# Altium schematic sheet EDU_High-Speed-Design_CPU_PCIe.SchDoc: CPU PCIe
size 279 x 215 mm; Date: not used; ApprovedBy: not used; CheckedBy: not used; Author: not used; DrawnBy: not used; Organization: not used; Address4: not used; SheetNumber: 20; SheetTotal: 26; Time: not used; ImagePath: not used; Application_BuildNumber: not used
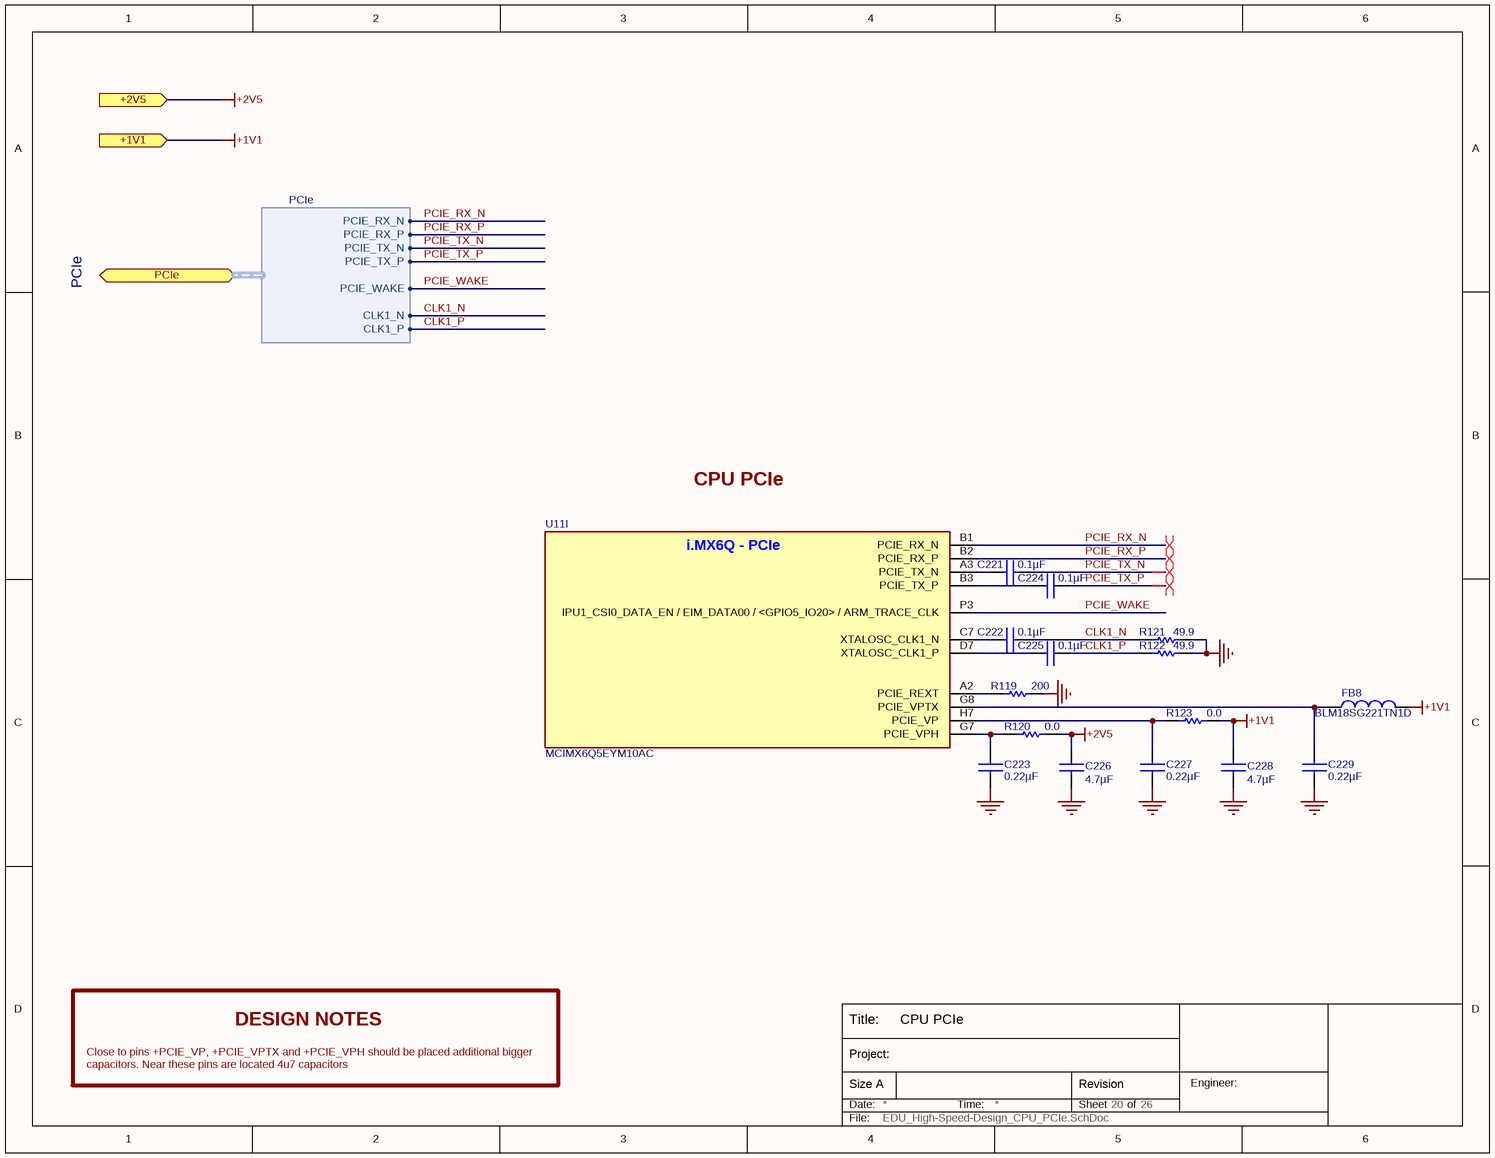
[diagram p0: EDU_High-Speed-Design_CPU_PCIe.SchDoc]

## Parts
C221  0.1µF  [C0402]
C222  0.1µF  [C0402]
C223  0.22µF  [C0402]
C224  0.1µF  [C0402]
C225  0.1µF  [C0402]
C226  4.7µF  [C0402]
C227  0.22µF  [C0402]
C228  4.7µF  [C0402]
C229  0.22µF  [C0402]
FB8  BLM18SG221TN1D  [L0603]
R119  200  [R0402]
R120  0.0  [R0402]
R121  49.9  [R0402]
R122  49.9  [R0402]
R123  0.0  [R0402]
U11  MCIMX6Q5EYM10AC  [MCIMX6Q5EYM10AC]  (part I of 15)

## Ports
+1V1 (in), +2V5 (in), PCIe (bidir, harness PCIe)

## Harnesses
PCIe: PCIE_RX_N, PCIE_TX_P, PCIE_TX_N, PCIE_WAKE, PCIE_RX_P, CLK1_N, CLK1_P

## Nets
+1V1: C228.1 FB8.2 R123.2 ; port +1V1
+2V5: C226.1 R120.2 ; port +2V5
GND: C223.2 C226.2 C227.2 C228.2 C229.2 R119.1 R121.1 R122.1
CLK1_N: C222.2 R121.2 ; port PCIe.CLK1_N
CLK1_P: C225.2 R122.2 ; port PCIe.CLK1_P
PCIE_RX_N: U11.B1(PCIE_RX_N) ; port PCIe.PCIE_RX_N
PCIE_RX_P: U11.B2(PCIE_RX_P) ; port PCIe.PCIE_RX_P
PCIE_TX_N: C221.2 ; port PCIe.PCIE_TX_N
PCIE_TX_P: C224.2 ; port PCIe.PCIE_TX_P
PCIE_WAKE: U11.P3(IPU1_CSI0_DATA_EN_/_EIM_DATA00_/_<GPIO5_IO20>_/_ARM_TRACE_CLK) ; port PCIe.PCIE_WAKE
NetC221_1: C221.1 U11.A3(PCIE_TX_N)
NetC222_1: C222.1 U11.C7(XTALOSC_CLK1_N)
NetC223_1: C223.1 R120.1 U11.G7(PCIE_VPH)
NetC224_1: C224.1 U11.B3(PCIE_TX_P)
NetC225_1: C225.1 U11.D7(XTALOSC_CLK1_P)
NetC227_1: C227.1 R123.1 U11.H7(PCIE_VP)
NetC229_1: C229.1 FB8.1 U11.G8(PCIE_VPTX)
NetR119_2: R119.2 U11.A2(PCIE_REXT)

## Layout directives
differential pair: PCIE_RX_N, PCIE_RX_P, PCIE_TX_N, PCIE_TX_P

## Notes on the sheet
- PCIe
- CPU PCIe
- DESIGN NOTES
- Close to pins +PCIE_VP, +PCIE_VPTX and +PCIE_VPH should be placed additional bigger capacitors. Near these pins are located 4u7 capacitors
- Title:
- Date:
- Size A
- Project:
- Time:
- Sheet
- Revision
- of
- Engineer:
- File:
- (in symbol MCIMX6Q5EYM10AC, part I) i.MX6Q - PCIe

## Library data of the parts
C221 C222 C224 C225 = C1005X5R1H104K: CAP CER .10UF 50V X5R 10% 0402; Manufacturer 1: TDK Corporation; Capacitance: 0.1µF; Manufacturer Part Number 1: C1005X5R1H104K; Voltage: 50V; Supplier 1: Digi-Key; Supplier Part Number 1: 445-5942-1-ND; ComponentLink1URL: http://www.tdk.co.jp/tefe02/e412_c.pdf; ComponentLink1Description: http://www.tdk.co.jp/tefe02/e412_c.pdf
C223 C227 C229 = C1005X5R1E224M: CAP CER .22UF 25V X5R 20% 0402; Manufacturer 1: TDK Corporation; Capacitance: 0.22µF; Manufacturer Part Number 1: C1005X5R1E224M; Voltage: 25V; Supplier 1: Digi-Key; Supplier Part Number 1: 445-5945-1-ND; ComponentLink1URL: http://www.tdk.co.jp/tefe02/e412_c.pdf; ComponentLink1Description: http://www.tdk.co.jp/tefe02/e412_c.pdf
C226 C228 = C1005X5R1A475M: CAP CER 4.7UF 10V 20% X5R 0402; Manufacturer 1: TDK Corporation; Supplier 1: Digi-Key; Supplier Part Number 1: 445-8023-1-ND; Manufacturer Part Number 1: C1005X5R1A475M; Capacitance: 4.7µF; Voltage: 10V; ComponentLink1URL: http://www.tdk.com/pdf/general_B11.pdf; ComponentLink1Description: http://www.tdk.com/pdf/general_B11.pdf
FB8 = BLM18SG221TN1D: FERRITE CHIP 220 OHM 2500MA 0603; Manufacturer 1: Murata Electronics North America; Supplier 1: Digi-Key; Supplier Part Number 1: 490-5225-1-ND; Manufacturer Part Number 1: BLM18SG221TN1D; ComponentLink1URL: http://search.murata.co.jp/Ceramy/image/img/PDF/ENG/L0110S0100BLM18S.pdf; ComponentLink1Description: http://search.murata.co.jp/Ceramy/image/img/PDF/ENG/L0110S0100BLM18S.pdf
R119 = CRCW0402200RFKED: RES 200 OHM 1/16W 1% 0402 SMD; Manufacturer 1: Vishay Dale; Supplier 1: Digi-Key; Manufacturer Part Number 1: CRCW0402200RFKED; Resistance: 200; ComponentLink1URL: http://www.vishay.com/doc?20035; ComponentLink1Description: http://www.vishay.com/doc?20035; Supplier Part Number 1: 541-200LCT-ND
R120 R123 = RC0402JR-070RL: RES 0.0 OHM 1/16W 0402 SMD; Manufacturer 1: Yageo; Manufacturer Part Number 1: RC0402JR-070RL; Resistance: 0.0; Supplier 1: Digi-Key; Supplier Part Number 1: 311-0.0JRCT-ND; ComponentLink1URL: http://www.yageo.com/documents/recent/PYu-RC0402_51_RoHS_L_6.pdf; ComponentLink1Description: http://www.yageo.com/documents/recent/PYu-RC0402_51_RoHS_L_6.pdf
R121 R122 = RC0402FR-0749R9L: RES 49.9 OHM 1/16W 1% 0402 SMD; Manufacturer 1: Yageo; Manufacturer Part Number 1: RC0402FR-0749R9L; Resistance: 49.9; Supplier 1: Digi-Key; Supplier Part Number 1: 311-49.9LRCT-ND; ComponentLink1URL: http://www.yageo.com/documents/recent/PYu-RC0402_51_RoHS_L_6.pdf; ComponentLink1Description: http://www.yageo.com/documents/recent/PYu-RC0402_51_RoHS_L_6.pdf
U11 = MCIMX6Q5EYM10AC: IC MCU 32BIT ARM QUAD 624FCBGA; Manufacturer 1: Freescale Semiconductor; Supplier 1: Digi-Key; Manufacturer Part Number 1: MCIMX6Q5EYM10AC; Supplier Part Number 1: MCIMX6Q5EYM10AC-ND